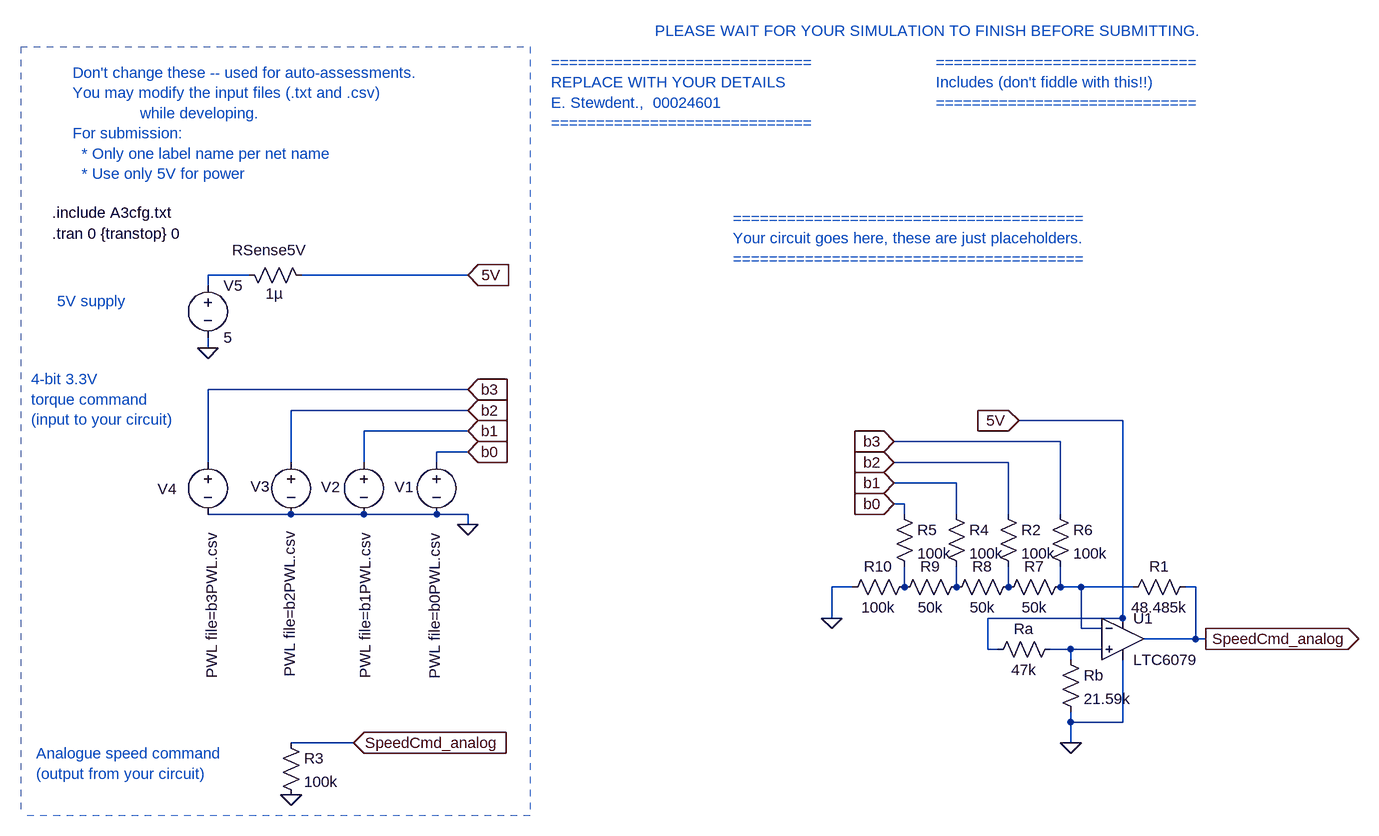
[diagram p0: schematic E344_23905093_A3.asc]
E344_23905093_A3.asc, the LTspice schematic file:
Version 4
SHEET 1 1824 2192
WIRE -2016 -1072 -2080 -1072
WIRE -1680 -1072 -1936 -1072
WIRE -2080 -1056 -2080 -1072
WIRE -2080 -960 -2080 -976
WIRE -1680 -896 -2080 -896
WIRE -1680 -864 -1952 -864
WIRE -672 -848 -832 -848
WIRE -1680 -832 -1840 -832
WIRE -768 -816 -1024 -816
WIRE -1680 -800 -1728 -800
WIRE -2080 -784 -2080 -896
WIRE -1952 -784 -1952 -864
WIRE -1840 -784 -1840 -832
WIRE -1728 -784 -1728 -800
WIRE -848 -784 -1024 -784
WIRE -928 -752 -1024 -752
WIRE -1008 -720 -1024 -720
WIRE -1952 -704 -2080 -704
WIRE -1840 -704 -1952 -704
WIRE -1728 -704 -1840 -704
WIRE -1680 -704 -1728 -704
WIRE -1008 -704 -1008 -720
WIRE -928 -704 -928 -752
WIRE -848 -704 -848 -784
WIRE -768 -704 -768 -816
WIRE -1680 -688 -1680 -704
WIRE -1088 -592 -1120 -592
WIRE -1008 -592 -1008 -624
WIRE -928 -592 -928 -624
WIRE -848 -592 -848 -624
WIRE -768 -592 -768 -624
WIRE -736 -592 -768 -592
WIRE -656 -592 -736 -592
WIRE -560 -592 -576 -592
WIRE -1120 -544 -1120 -592
WIRE -672 -544 -672 -848
WIRE -672 -544 -880 -544
WIRE -736 -528 -736 -592
WIRE -704 -528 -736 -528
WIRE -560 -512 -560 -592
WIRE -560 -512 -640 -512
WIRE -544 -512 -560 -512
WIRE -880 -496 -880 -544
WIRE -864 -496 -880 -496
WIRE -752 -496 -784 -496
WIRE -704 -496 -752 -496
WIRE -752 -480 -752 -496
WIRE -752 -384 -752 -400
WIRE -672 -384 -672 -480
WIRE -672 -384 -752 -384
WIRE -1856 -352 -1952 -352
WIRE -752 -352 -752 -384
FLAG -1680 -1072 5V
IOPIN -1680 -1072 In
FLAG -2080 -960 0
FLAG -832 -848 5V
IOPIN -832 -848 In
FLAG -544 -512 SpeedCmd_analog
IOPIN -544 -512 Out
FLAG -1680 -688 0
FLAG -1680 -896 b3
IOPIN -1680 -896 In
FLAG -1680 -864 b2
IOPIN -1680 -864 In
FLAG -1680 -832 b1
IOPIN -1680 -832 In
FLAG -1680 -800 b0
IOPIN -1680 -800 In
FLAG -1024 -816 b3
IOPIN -1024 -816 In
FLAG -1024 -784 b2
IOPIN -1024 -784 In
FLAG -1024 -752 b1
IOPIN -1024 -752 In
FLAG -1024 -720 b0
IOPIN -1024 -720 In
FLAG -1856 -352 SpeedCmd_analog
IOPIN -1856 -352 In
FLAG -1952 -272 0
FLAG -1120 -544 0
FLAG -752 -352 0
SYMBOL voltage -2080 -1072 R0
WINDOW 123 0 0 Left 0
WINDOW 39 0 0 Left 0
SYMATTR InstName V5
SYMATTR Value 5
SYMBOL res -2032 -1088 M90
WINDOW 0 -7 47 VBottom 2
WINDOW 3 29 54 VTop 2
SYMATTR InstName RSense5V
SYMATTR Value 1µ
SYMBOL voltage -1728 -800 R0
WINDOW 3 -3 125 VRight 2
WINDOW 123 0 0 Left 0
WINDOW 39 0 0 Left 0
WINDOW 0 -65 54 Left 2
SYMATTR Value PWL file=b0PWL.csv
SYMATTR InstName V1
SYMBOL voltage -1840 -800 R0
WINDOW 3 2 124 VRight 2
WINDOW 123 0 0 Left 0
WINDOW 39 0 0 Left 0
WINDOW 0 -66 54 Left 2
SYMATTR Value PWL file=b1PWL.csv
SYMATTR InstName V2
SYMBOL voltage -1952 -800 R0
WINDOW 3 -2 122 VRight 2
WINDOW 123 0 0 Left 0
WINDOW 39 0 0 Left 0
WINDOW 0 -62 53 Left 2
SYMATTR Value PWL file=b2PWL.csv
SYMATTR InstName V3
SYMBOL voltage -2080 -800 R0
WINDOW 3 6 124 VRight 2
WINDOW 123 0 0 Left 0
WINDOW 39 0 0 Left 0
WINDOW 0 -77 57 Left 2
SYMATTR Value PWL file=b3PWL.csv
SYMATTR InstName V4
SYMBOL res -1968 -368 R0
SYMATTR InstName R3
SYMATTR Value 100k
SYMBOL OpAmps\\LTC6079 -672 -512 R0
SYMATTR InstName U1
SYMBOL res -560 -608 R90
WINDOW 0 0 56 VBottom 2
WINDOW 3 32 56 VTop 2
SYMATTR InstName R1
SYMATTR Value 48.485k
SYMBOL res -864 -720 R0
SYMATTR InstName R2
SYMATTR Value 100k
SYMBOL res -944 -720 R0
SYMATTR InstName R4
SYMATTR Value 100k
SYMBOL res -1024 -720 R0
SYMATTR InstName R5
SYMATTR Value 100k
SYMBOL res -784 -720 R0
SYMATTR InstName R6
SYMATTR Value 100k
SYMBOL res -752 -608 R90
WINDOW 0 0 56 VBottom 2
WINDOW 3 32 56 VTop 2
SYMATTR InstName R7
SYMATTR Value 50k
SYMBOL res -832 -608 R90
WINDOW 0 0 56 VBottom 2
WINDOW 3 32 56 VTop 2
SYMATTR InstName R8
SYMATTR Value 50k
SYMBOL res -912 -608 R90
WINDOW 0 0 56 VBottom 2
WINDOW 3 32 56 VTop 2
SYMATTR InstName R9
SYMATTR Value 50k
SYMBOL res -992 -608 R90
WINDOW 0 0 56 VBottom 2
WINDOW 3 32 56 VTop 2
SYMATTR InstName R10
SYMATTR Value 100k
SYMBOL res -768 -496 R0
SYMATTR InstName Rb
SYMATTR Value 21.59k
SYMBOL res -768 -512 R90
WINDOW 0 0 56 VBottom 2
WINDOW 3 32 56 VTop 2
SYMATTR InstName Ra
SYMATTR Value 47k
TEXT -2288 -1384 Left 2 ;Don't change these -- used for auto-assessments.\nYou may modify the input files (.txt and .csv) \n               while developing.\nFor submission: \n  * Only one label name per net name\n  * Use only 5V for power
TEXT -1552 -1400 Left 2 ;=============================\nREPLACE WITH YOUR DETAILS\nE. Stewdent.,  00024601\n=============================
TEXT -960 -1400 Left 2 ;=============================\nIncludes (don't fiddle with this!!)\n=============================
TEXT -1272 -1160 Left 2 ;=======================================\nYour circuit goes here, these are just placeholders.\n=======================================
TEXT -1392 -1448 Left 2 ;PLEASE WAIT FOR YOUR SIMULATION TO FINISH BEFORE SUBMITTING.
TEXT -2320 -1136 Left 2 !.tran 0 {transtop} 0
TEXT -2320 -1168 Left 2 !.include A3cfg.txt
TEXT -2312 -1032 Left 2 ;5V supply
TEXT -2352 -912 Left 2 ;4-bit 3.3V\ntorque command\n(input to your circuit)
TEXT -2344 -336 Left 2 ;Analogue speed command\n(output from your circuit)
LINE Normal -1584 -1424 -1584 -240 2
LINE Normal -2368 -1424 -1584 -1424 2
LINE Normal -1584 -240 -2368 -240 2
LINE Normal -1584 -256 -1584 -256 2
LINE Normal -2368 -1424 -2368 -240 2

The netlist it stands for:
* E344_23905093_A3.asc
V5 N001 0 5
RSense5V N001 5V 1µ
V1 b0 0 PWL file=b0PWL.csv
V2 b1 0 PWL file=b1PWL.csv
V3 b2 0 PWL file=b2PWL.csv
V4 b3 0 PWL file=b3PWL.csv
R3 SpeedCmd_analog 0 100k
XU1 N006 N005 5V 0 SpeedCmd_analog LTC6078  ; LTC6079, pins In+ In- V+ V- OUT
R1 SpeedCmd_analog N005 48.485k
R2 b2 N004 100k
R4 b1 N003 100k
R5 b0 N002 100k
R6 b3 N005 100k
R7 N005 N004 50k
R8 N004 N003 50k
R9 N003 N002 50k
R10 N002 0 100k
Rb N006 0 21.59k
Ra N006 5V 47k
* Don't change these -- used for auto-assessments.
* You may modify the input files (.txt and .csv)
*                while developing.
* For submission:
*   * Only one label name per net name
*   * Use only 5V for power
* =============================
* REPLACE WITH YOUR DETAILS
* E. Stewdent.,  00024601
* =============================
* =============================
* Includes (don't fiddle with this!!)
* =============================
* =======================================
* Your circuit goes here, these are just placeholders.
* =======================================
* PLEASE WAIT FOR YOUR SIMULATION TO FINISH BEFORE SUBMITTING.
.tran 0 {transtop} 0
.include A3cfg.txt
* 5V supply
* 4-bit 3.3V
* torque command
* (input to your circuit)
* Analogue speed command
* (output from your circuit)
.lib LTC5.lib
.backanno
.end